# Altium schematic sheet top.SchDoc
size C; SheetNumber: 1
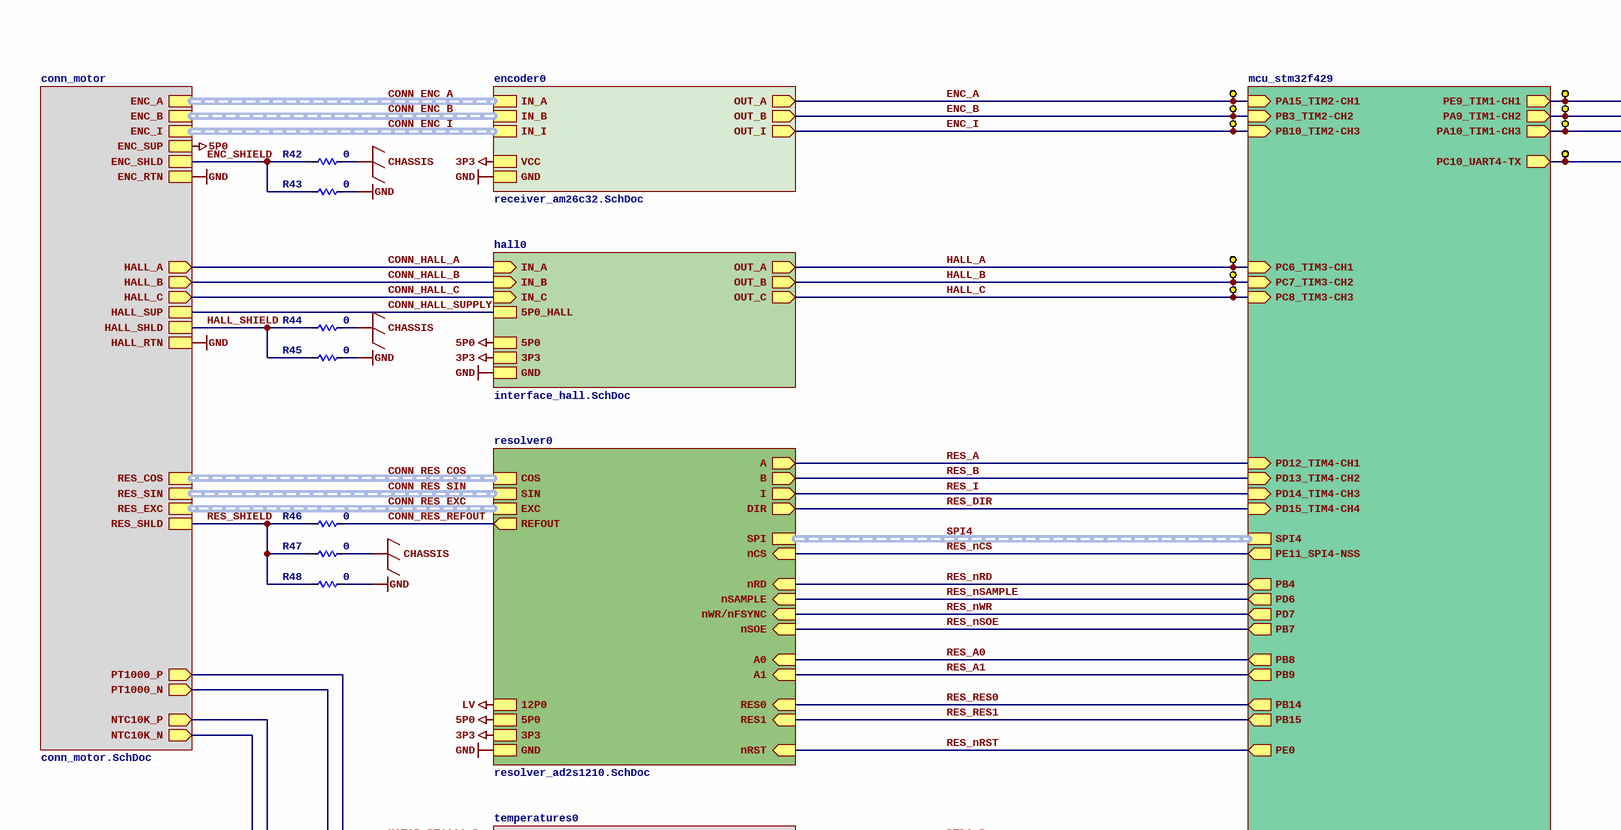
[diagram p0: top.SchDoc, top left]
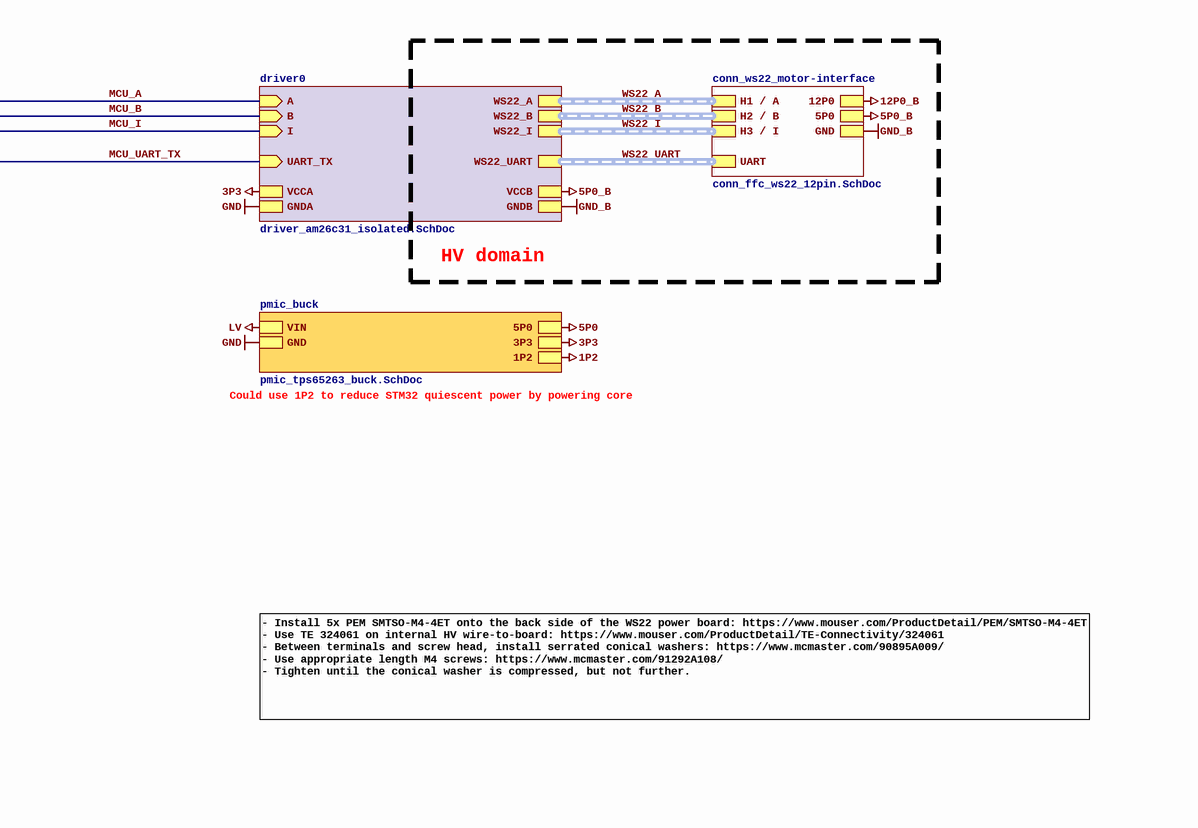
[diagram p1: top.SchDoc, top right]
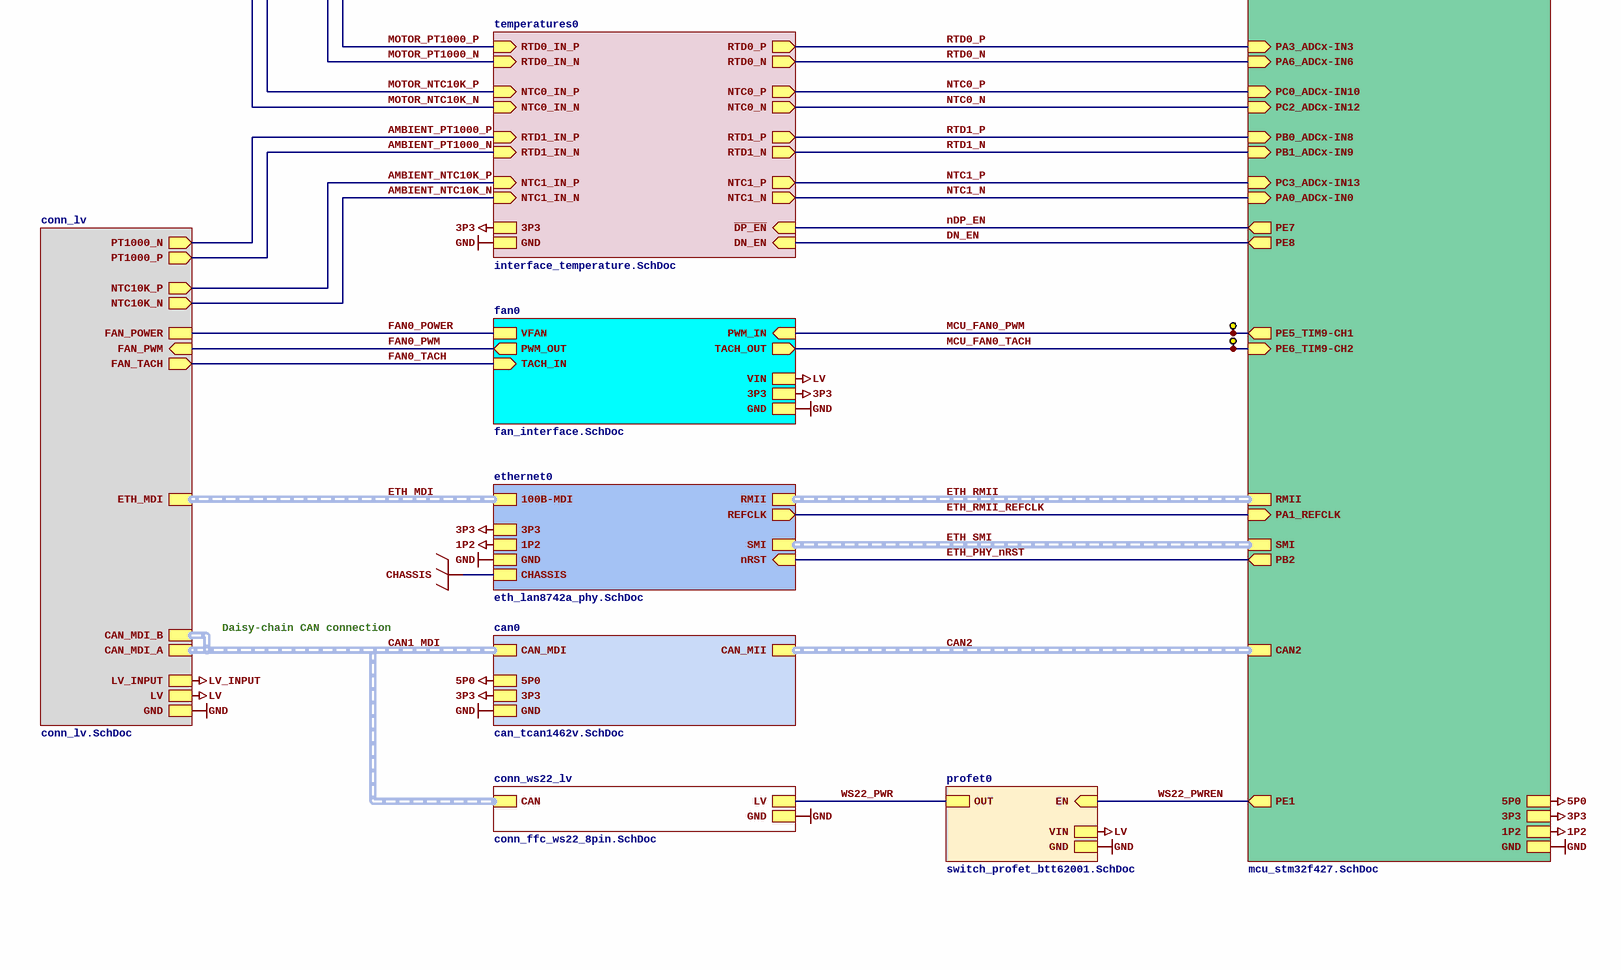
[diagram p2: top.SchDoc, bottom left]
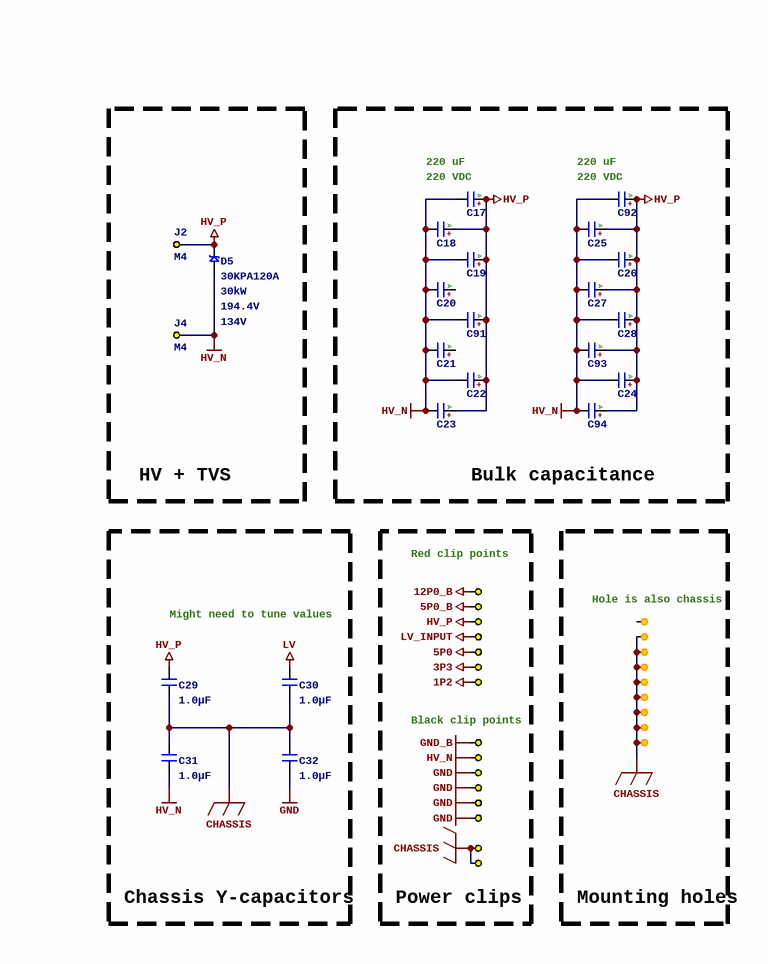
[diagram p3: top.SchDoc, bottom right]

## Parts
C17  EKXJ221ELL221MM25S  [CAP_1600X2700X750]  (value not drawn)
C18  EKXJ221ELL221MM25S  [CAP_1600X2700X750]  (value not drawn)
C19  EKXJ221ELL221MM25S  [CAP_1600X2700X750]  (value not drawn)
C20  EKXJ221ELL221MM25S  [CAP_1600X2700X750]  (value not drawn)
C21  EKXJ221ELL221MM25S  [CAP_1600X2700X750]  (value not drawn)
C22  EKXJ221ELL221MM25S  [CAP_1600X2700X750]  (value not drawn)
C23  EKXJ221ELL221MM25S  [CAP_1600X2700X750]  (value not drawn)
C24  EKXJ221ELL221MM25S  [CAP_1600X2700X750]  (value not drawn)
C25  EKXJ221ELL221MM25S  [CAP_1600X2700X750]  (value not drawn)
C26  EKXJ221ELL221MM25S  [CAP_1600X2700X750]  (value not drawn)
C27  EKXJ221ELL221MM25S  [CAP_1600X2700X750]  (value not drawn)
C28  EKXJ221ELL221MM25S  [CAP_1600X2700X750]  (value not drawn)
C29  Capacitance: 1.0µF  [KNSCHA-CAP-MPB-S]  (hidden comment: MPB105J2WD4KN1580S)
C30  Capacitance: 1.0µF  [KNSCHA-CAP-MPB-S]  (hidden comment: MPB105J2WD4KN1580S)
C31  Capacitance: 1.0µF  [KNSCHA-CAP-MPB-S]  (hidden comment: MPB105J2WD4KN1580S)
C32  Capacitance: 1.0µF  [KNSCHA-CAP-MPB-S]  (hidden comment: MPB105J2WD4KN1580S)
C91  EKXJ221ELL221MM25S  [CAP_1600X2700X750]  (value not drawn)
C92  EKXJ221ELL221MM25S  [CAP_1600X2700X750]  (value not drawn)
C93  EKXJ221ELL221MM25S  [CAP_1600X2700X750]  (value not drawn)
C94  EKXJ221ELL221MM25S  [CAP_1600X2700X750]  (value not drawn)
D5  30KPA120A  Non-rep Peak Rev Power Dis-Max: 30kW  Clamping Voltage-Max: 194.4V  Min Breakdown Voltage: 134V  [P600]
J2  Thread Size: M4  [WURTH_TERM_7461086]  (hidden comment: 7461086)
J4  Thread Size: M4  [WURTH_TERM_7461086]  (hidden comment: 7461086)
MH1  HOLE_M3  [HOLE_M3]  (value not drawn)  (no BOM)
MH2  HOLE_M3  [HOLE_M3]  (value not drawn)  (no BOM)
MH3  HOLE_M3  [HOLE_M3]  (value not drawn)  (no BOM)
MH4  HOLE_M3  [HOLE_M3]  (value not drawn)  (no BOM)
MH5  HOLE_M3  [HOLE_M3]  (value not drawn)  (no BOM)
MH6  HOLE_M3  [HOLE_M3]  (value not drawn)  (no BOM)
MH7  HOLE_M3  [HOLE_M3]  (value not drawn)  (no BOM)
MH8  HOLE_M3  [HOLE_M3]  (value not drawn)  (no BOM)
MH9  HOLE_M3  [HOLE_M3]  (value not drawn)  (no BOM)
R42  Resistance: 0  [R0402_0.40MM]  (hidden comment: ERJ-2GE0R00X)
R43  Resistance: 0  [R0402_0.40MM]  (hidden comment: ERJ-2GE0R00X)
R44  Resistance: 0  [R0402_0.40MM]  (hidden comment: ERJ-2GE0R00X)
R45  Resistance: 0  [R0402_0.40MM]  (hidden comment: ERJ-2GE0R00X)
R46  Resistance: 0  [R0402_0.40MM]  (hidden comment: ERJ-2GE0R00X)
R47  Resistance: 0  [R0402_0.40MM]  (hidden comment: ERJ-2GE0R00X)
R48  Resistance: 0  [R0402_0.40MM]  (hidden comment: ERJ-2GE0R00X)
TP8  (no value)  [TP_GRABBY]  (no BOM)
TP9  (no value)  [TP_GRABBY]  (no BOM)
TP10  (no value)  [TP_GRABBY]  (no BOM)
TP11  (no value)  [TP_GRABBY]  (no BOM)
TP12  (no value)  [TP_GRABBY]  (no BOM)
TP13  (no value)  [TP_GRABBY]  (no BOM)
TP14  (no value)  [TP_GRABBY]  (no BOM)
TP15  (no value)  [TP_GRABBY]  (no BOM)
TP16  (no value)  [TP_GRABBY]  (no BOM)
TP17  (no value)  [TP_GRABBY]  (no BOM)
TP32  (no value)  [TP_GRABBY]  (no BOM)
TP33  (no value)  [TP_GRABBY]  (no BOM)
TP37  RH-5000  [TP_RH-5000]  (value not drawn)
TP38  RH-5000  [TP_RH-5000]  (value not drawn)
TP39  RH-5000  [TP_RH-5000]  (value not drawn)
TP41  RH-5000  [TP_RH-5000]  (value not drawn)
TP42  RH-5000  [TP_RH-5000]  (value not drawn)
TP43  RH-5000  [TP_RH-5000]  (value not drawn)
TP44  RH-5000  [TP_RH-5000]  (value not drawn)
TP45  RH-5001  [TP_RH-5001]  (value not drawn)
TP47  RH-5001  [TP_RH-5001]  (value not drawn)
TP48  RH-5001  [TP_RH-5001]  (value not drawn)
TP49  RH-5001  [TP_RH-5001]  (value not drawn)
TP50  RH-5001  [TP_RH-5001]  (value not drawn)
TP51  RH-5001  [TP_RH-5001]  (value not drawn)
TP52  RH-5001  [TP_RH-5001]  (value not drawn)
TP53  RH-5001  [TP_RH-5001]  (value not drawn)

## Blocks framed on the sheet
HV + TVS: D5 J2 J4
Bulk capacitance: C17-C28 C91-C94
Chassis Y-capacitors: C29-C32
Power clips: TP37-TP39 TP41-TP45 TP47-TP53
Mounting holes: MH1-MH9

## Sub-sheets
can0 = can_tcan1462v.SchDoc: GND, 5P0, CAN_MII (harness CAN), CAN_MDI (harness DIFF), 3P3
conn_lv = conn_lv.SchDoc: ETH_MDI (harness 100BASE-TX), CAN_MDI_A (harness DIFF), FAN_PWM (in), FAN_TACH (out), GND, LV, PT1000_N (out), PT1000_P (out), FAN_POWER, CAN_MDI_B (harness DIFF), NTC10K_P (out), NTC10K_N (out), LV_INPUT
conn_motor = conn_motor.SchDoc: RES_SHLD, RES_EXC (harness DIFF), RES_COS (harness DIFF), RES_SIN (harness DIFF), PT1000_P (out), PT1000_N (out), NTC10K_P (out), NTC10K_N (out), ENC_A (harness DIFF), ENC_B (harness DIFF), ENC_I (harness DIFF), ENC_SHLD, ENC_SUP, ENC_RTN, HALL_RTN, HALL_SUP, HALL_A (out), HALL_B (out), HALL_C (out), HALL_SHLD
conn_ws22_lv = conn_ffc_ws22_8pin.SchDoc: CAN (harness DIFF), GND, LV
conn_ws22_motor-interface = conn_ffc_ws22_12pin.SchDoc: H1 / A (harness DIFF), H2 / B (harness DIFF), H3 / I (harness DIFF), UART (harness DIFF), GND, 12P0, 5P0
driver0 = driver_am26c31_isolated.SchDoc: WS22_UART (harness DIFF), WS22_I (harness DIFF), WS22_B (harness DIFF), WS22_A (harness DIFF), UART_TX (in), I (in), B (in), A (in), VCCB, GNDB, VCCA, GNDA
encoder0 = receiver_am26c32.SchDoc: VCC, GND, IN_I (harness DIFF), IN_B (harness DIFF), IN_A (harness DIFF), OUT_I (out), OUT_B (out), OUT_A (out)
ethernet0 = eth_lan8742a_phy.SchDoc: 3P3, 1P2, GND, REFCLK (out), SMI (harness SMI), RMII (harness RMII), 100B-MDI (harness 100BASE-TX), nRST (in), CHASSIS
fan0 = fan_interface.SchDoc: GND, 3P3, VFAN, PWM_IN (in), TACH_IN (in), VIN, TACH_OUT (out), PWM_OUT (out)
hall0 = interface_hall.SchDoc: IN_B (in), IN_A (in), IN_C (in), OUT_B (out), OUT_A (out), OUT_C (out), 5P0, 3P3, GND, 5P0_HALL
mcu_stm32f429 = mcu_stm32f427.SchDoc: GND, 3P3, CAN2 (harness CAN), PA1_REFCLK (in), RMII (harness RMII), SMI (harness SMI), 5P0, 1P2, PA15_TIM2-CH1 (in), PE7 (out), PE8 (out), PA0_ADCx-IN0 (in), PC3_ADCx-IN13 (in), PB1_ADCx-IN9 (in), PB0_ADCx-IN8 (in), PC2_ADCx-IN12 (in), PC0_ADCx-IN10 (in), PA6_ADCx-IN6 (in), PA3_ADCx-IN3 (in), PC8_TIM3-CH3 (in), PB3_TIM2-CH2 (in), PC6_TIM3-CH1 (in), PC7_TIM3-CH2 (in), PB10_TIM2-CH3 (in), PD12_TIM4-CH1 (in), PD13_TIM4-CH2 (in), PD14_TIM4-CH3 (in), PD15_TIM4-CH4 (in), SPI4 (harness SPI), PE11_SPI4-NSS (out), PB4 (out), PD6 (out), PD7 (out), PB7 (out), PB8 (out), PB9 (out), PB14 (out), PB15 (out), PE0 (out), PE9_TIM1-CH1 (out), PA9_TIM1-CH2 (out), PA10_TIM1-CH3 (out), PC10_UART4-TX (out), PE5_TIM9-CH1 (out), PE6_TIM9-CH2 (in), PB2 (out), PE1 (out)
pmic_buck = pmic_tps65263_buck.SchDoc: VIN, 5P0, GND, 3P3, 1P2
profet0 = switch_profet_btt62001.SchDoc: EN (in), GND, OUT, VIN
resolver0 = resolver_ad2s1210.SchDoc: COS (harness DIFF), SIN (harness DIFF), REFOUT (out), EXC (harness DIFF), 12P0, 5P0, GND, RES0 (in), RES1 (in), A (out), B (out), I (out), DIR (out), nRST (in), A0 (in), A1 (in), 3P3, SPI (harness SPI), nRD (in), nCS (in), nSAMPLE (in), nWR/nFSYNC (in), nSOE (in)
temperatures0 = interface_temperature.SchDoc: NTC0_P (out), NTC0_N (out), NTC1_P (out), NTC1_N (out), RTD0_P (out), RTD0_N (out), RTD1_P (out), RTD1_N (out), 3P3, GND, DN_EN (in), ~{DP_EN} (in), NTC0_IN_P (in), NTC0_IN_N (in), NTC1_IN_P (in), NTC1_IN_N (in), RTD0_IN_P (in), RTD0_IN_N (in), RTD1_IN_P (in), RTD1_IN_N (in)

## Nets
1P2: TP44.1 ; sheet mcu_stm32f429/1P2, sheet pmic_buck/1P2, sheet ethernet0/1P2
3P3: TP43.1 ; sheet mcu_stm32f429/3P3, sheet pmic_buck/3P3, sheet fan0/3P3, sheet can0/3P3, sheet ethernet0/3P3, sheet driver0/VCCA, sheet resolver0/3P3, sheet hall0/3P3, sheet encoder0/VCC, sheet temperatures0/3P3
5P0: TP42.1 ; sheet mcu_stm32f429/5P0, sheet pmic_buck/5P0, sheet can0/5P0, sheet conn_motor/ENC_SUP, sheet resolver0/5P0, sheet hall0/5P0
5P0_B: TP38.1 ; sheet conn_ws22_motor-interface/5P0, sheet driver0/VCCB
12P0_B: TP37.1 ; sheet conn_ws22_motor-interface/12P0
CHASSIS: C29.2 C30.2 C31.1 C32.1 MH1.0 MH2.0 MH3.0 MH4.0 MH5.0 MH6.0 MH7.0 MH8.0 R42.1 R44.1 R47.1 TP52.1 TP53.1 ; sheet ethernet0/CHASSIS
GND: C32.2 R43.1 R45.1 R48.1 TP48.1 TP49.1 TP50.1 TP51.1 ; sheet mcu_stm32f429/GND, sheet pmic_buck/GND, sheet fan0/GND, sheet can0/GND, sheet ethernet0/GND, sheet conn_ws22_lv/GND, sheet conn_lv/GND, sheet conn_motor/ENC_RTN, sheet conn_motor/HALL_RTN, sheet driver0/GNDA, sheet resolver0/GND, sheet profet0/GND, sheet hall0/GND, sheet encoder0/GND, sheet temperatures0/GND
GND_B: TP45.1 ; sheet conn_ws22_motor-interface/GND, sheet driver0/GNDB
HV_N: C17.2 C18.2 C19.2 C20.2 C21.2 C22.2 C23.2 C24.2 C25.2 C26.2 C27.2 C28.2 C31.2 C91.2 C92.2 C93.2 C94.2 D5.1 J4.0 TP47.1
HV_P: C17.1 C18.1 C19.1 C22.1 C23.1 C24.1 C25.1 C26.1 C27.1 C28.1 C29.1 C91.1 C92.1 C93.1 C94.1 D5.2 J2.0 TP39.1
LV: C30.1 ; sheet pmic_buck/VIN, sheet fan0/VIN, sheet conn_lv/LV, sheet resolver0/12P0, sheet profet0/VIN
LV_INPUT: TP41.1 ; sheet conn_lv/LV_INPUT
AMBIENT_NTC10K_N: sheet conn_lv/NTC10K_N, sheet temperatures0/NTC1_IN_N
AMBIENT_NTC10K_P: sheet conn_lv/NTC10K_P, sheet temperatures0/NTC1_IN_P
AMBIENT_PT1000_N: sheet conn_lv/PT1000_P, sheet temperatures0/RTD1_IN_N
AMBIENT_PT1000_P: sheet conn_lv/PT1000_N, sheet temperatures0/RTD1_IN_P
CONN_HALL_A: sheet conn_motor/HALL_A, sheet hall0/IN_A
CONN_HALL_B: sheet conn_motor/HALL_B, sheet hall0/IN_B
CONN_HALL_C: sheet conn_motor/HALL_C, sheet hall0/IN_C
CONN_HALL_SUPPLY: sheet conn_motor/HALL_SUP, sheet hall0/5P0_HALL
CONN_RES_REFOUT: R46.1 ; sheet resolver0/REFOUT
DN_EN: sheet mcu_stm32f429/PE8, sheet temperatures0/DN_EN
ENC_A: TP8.1 ; sheet mcu_stm32f429/PA15_TIM2-CH1, sheet encoder0/OUT_A
ENC_B: TP10.1 ; sheet mcu_stm32f429/PB3_TIM2-CH2, sheet encoder0/OUT_B
ENC_I: TP12.1 ; sheet mcu_stm32f429/PB10_TIM2-CH3, sheet encoder0/OUT_I
ENC_SHIELD: R42.2 R43.2 ; sheet conn_motor/ENC_SHLD
ETH_PHY_nRST: sheet mcu_stm32f429/PB2, sheet ethernet0/nRST
ETH_RMII_REFCLK: sheet mcu_stm32f429/PA1_REFCLK, sheet ethernet0/REFCLK
FAN0_POWER: sheet fan0/VFAN, sheet conn_lv/FAN_POWER
FAN0_PWM: sheet fan0/PWM_OUT, sheet conn_lv/FAN_PWM
FAN0_TACH: sheet fan0/TACH_IN, sheet conn_lv/FAN_TACH
HALL_A: TP15.1 ; sheet mcu_stm32f429/PC6_TIM3-CH1, sheet hall0/OUT_A
HALL_B: TP16.1 ; sheet mcu_stm32f429/PC7_TIM3-CH2, sheet hall0/OUT_B
HALL_C: TP17.1 ; sheet mcu_stm32f429/PC8_TIM3-CH3, sheet hall0/OUT_C
HALL_SHIELD: R44.2 R45.2 ; sheet conn_motor/HALL_SHLD
MCU_A: TP9.1 ; sheet mcu_stm32f429/PE9_TIM1-CH1, sheet driver0/A
MCU_B: TP11.1 ; sheet mcu_stm32f429/PA9_TIM1-CH2, sheet driver0/B
MCU_FAN0_PWM: TP32.1 ; sheet mcu_stm32f429/PE5_TIM9-CH1, sheet fan0/PWM_IN
MCU_FAN0_TACH: TP33.1 ; sheet mcu_stm32f429/PE6_TIM9-CH2, sheet fan0/TACH_OUT
MCU_I: TP13.1 ; sheet mcu_stm32f429/PA10_TIM1-CH3, sheet driver0/I
MCU_UART_TX: TP14.1 ; sheet mcu_stm32f429/PC10_UART4-TX, sheet driver0/UART_TX
MOTOR_NTC10K_N: sheet conn_motor/NTC10K_N, sheet temperatures0/NTC0_IN_N
MOTOR_NTC10K_P: sheet conn_motor/NTC10K_P, sheet temperatures0/NTC0_IN_P
MOTOR_PT1000_N: sheet conn_motor/PT1000_N, sheet temperatures0/RTD0_IN_N
MOTOR_PT1000_P: sheet conn_motor/PT1000_P, sheet temperatures0/RTD0_IN_P
nDP_EN: sheet mcu_stm32f429/PE7, sheet temperatures0/~{DP_EN}
NTC0_N: sheet mcu_stm32f429/PC2_ADCx-IN12, sheet temperatures0/NTC0_N
NTC0_P: sheet mcu_stm32f429/PC0_ADCx-IN10, sheet temperatures0/NTC0_P
NTC1_N: sheet mcu_stm32f429/PA0_ADCx-IN0, sheet temperatures0/NTC1_N
NTC1_P: sheet mcu_stm32f429/PC3_ADCx-IN13, sheet temperatures0/NTC1_P
RES_A: sheet mcu_stm32f429/PD12_TIM4-CH1, sheet resolver0/A
RES_A0: sheet mcu_stm32f429/PB8, sheet resolver0/A0
RES_A1: sheet mcu_stm32f429/PB9, sheet resolver0/A1
RES_B: sheet mcu_stm32f429/PD13_TIM4-CH2, sheet resolver0/B
RES_DIR: sheet mcu_stm32f429/PD15_TIM4-CH4, sheet resolver0/DIR
RES_I: sheet mcu_stm32f429/PD14_TIM4-CH3, sheet resolver0/I
RES_nCS: sheet mcu_stm32f429/PE11_SPI4-NSS, sheet resolver0/nCS
RES_nRD: sheet mcu_stm32f429/PB4, sheet resolver0/nRD
RES_nRST: sheet mcu_stm32f429/PE0, sheet resolver0/nRST
RES_nSAMPLE: sheet mcu_stm32f429/PD6, sheet resolver0/nSAMPLE
RES_nSOE: sheet mcu_stm32f429/PB7, sheet resolver0/nSOE
RES_nWR: sheet mcu_stm32f429/PD7, sheet resolver0/nWR/nFSYNC
RES_RES0: sheet mcu_stm32f429/PB14, sheet resolver0/RES0
RES_RES1: sheet mcu_stm32f429/PB15, sheet resolver0/RES1
RES_SHIELD: R46.2 R47.2 R48.2 ; sheet conn_motor/RES_SHLD
RTD0_N: sheet mcu_stm32f429/PA6_ADCx-IN6, sheet temperatures0/RTD0_N
RTD0_P: sheet mcu_stm32f429/PA3_ADCx-IN3, sheet temperatures0/RTD0_P
RTD1_N: sheet mcu_stm32f429/PB1_ADCx-IN9, sheet temperatures0/RTD1_N
RTD1_P: sheet mcu_stm32f429/PB0_ADCx-IN8, sheet temperatures0/RTD1_P
WS22_PWR: sheet conn_ws22_lv/LV, sheet profet0/OUT
WS22_PWREN: sheet mcu_stm32f429/PE1, sheet profet0/EN

Not connected (* = marked no-connect by the designer): C20 1; C21 1; MH9 0

## Buses and harness runs
harness CAN1_MDI = sheet can0/CAN_MDI = sheet conn_lv/CAN_MDI_A = sheet conn_lv/CAN_MDI_B = sheet conn_ws22_lv/CAN
harness CAN2 = sheet can0/CAN_MII = sheet mcu_stm32f429/CAN2
harness CONN_ENC_A = sheet conn_motor/ENC_A = sheet encoder0/IN_A
harness CONN_ENC_B = sheet conn_motor/ENC_B = sheet encoder0/IN_B
harness CONN_ENC_I = sheet conn_motor/ENC_I = sheet encoder0/IN_I
harness CONN_RES_COS = sheet conn_motor/RES_COS = sheet resolver0/COS
harness CONN_RES_EXC = sheet conn_motor/RES_EXC = sheet resolver0/EXC
harness CONN_RES_SIN = sheet conn_motor/RES_SIN = sheet resolver0/SIN
harness ETH_MDI = sheet conn_lv/ETH_MDI = sheet ethernet0/100B-MDI
harness ETH_RMII = sheet ethernet0/RMII = sheet mcu_stm32f429/RMII
harness ETH_SMI = sheet ethernet0/SMI = sheet mcu_stm32f429/SMI
harness SPI4 = sheet mcu_stm32f429/SPI4 = sheet resolver0/SPI
harness WS22_A = sheet conn_ws22_motor-interface/H1 / A = sheet driver0/WS22_A
harness WS22_B = sheet conn_ws22_motor-interface/H2 / B = sheet driver0/WS22_B
harness WS22_I = sheet conn_ws22_motor-interface/H3 / I = sheet driver0/WS22_I
harness WS22_UART = sheet conn_ws22_motor-interface/UART = sheet driver0/WS22_UART

## Notes on the sheet
- HV domain
- Could use 1P2 to reduce STM32 quiescent power by powering core
- - Install 5x PEM SMTSO-M4-4ET onto the back side of the WS22 power board: https://www.mouser.com/ProductDetail/PEM/SMTSO-M4-4ET
  - Use TE 324061 on internal HV wire-to-board: https://www.mouser.com/ProductDetail/TE-Connectivity/324061
  - Between terminals and screw head, install serrated conical washers: https://www.mcmaster.com/90895A009/
  - Use appropriate length M4 screws: https://www.mcmaster.com/91292A108/
  - Tighten until the conical washer is compressed, but not further.
- (near C17) 220 uF
- (near C17) 220 VDC
- (near C92) 220 uF
- (near C92) 220 VDC
- Daisy-chain CAN connection
- Red clip points
- (near MH9) Hole is also chassis
- Might need to tune values
- (near TP45) Black clip points
- (in symbol AUTO_CAP_ALUM_220UF_220V_EKXJ221ELL221MM25S) A; +

## Library data of the parts
C17-C28 C91-C94 = AUTO_CAP_ALUM_220UF_220V_EKXJ221ELL221MM25S: Aluminum Electrolytic Capacitor, Polarized, Aluminum (wet), 220V, 20% +Tol, 20% -Tol, 220uF, Through Hole Mount; Manufacturer: United Chemi-Con; Manufacturer Part Number: EKXJ221ELL221MM25S; ComponentLink4URL: http://www.chemi-con.co.jp/cgi-bin/CAT_DB/SEARCH/cat_db_al.cgi?e=e&amp;j=p&amp;pdfname=kxj; ComponentLink4Description: Datasheet; Supplier 1: Digikey; Supplier Part Number 1: 565-EKXJ221ELL221MM25S-ND; Supplier 2: LCSC; Supplier Part Number 2: C1600234
C29-C32 = CAP_FILM_1UF_450V: CAP FILM 1UF 5% 450V RADIAL; Manufacturer: KNSCHA; Supplier 1: LCSC; Manufacturer Part Number: MPB105J2WD4KN1580S; ComponentLink1URL: https://www.lcsc.com/datasheet/lcsc_datasheet_2405161619_KNSCHA-MPB105J2WD4KN1580S_C22400108.pdf; ComponentLink1Description: Datasheet; Supplier Part Number 1: C22400108
D5 = TVS_UNI_30KPA120A: Trans Voltage Suppressor Diode, 30000W, 120V V(RWM), Unidirectional, 1 Element, Silicon; Manufacturer: Littelfuse; Supplier 1: Digikey; Supplier Part Number 1: 30KPA120A-ND; Manufacturer Part Number: 30KPA120A; ComponentLink1URL: https://mm.digikey.com/Volume0/opasdata/d220001/medias/docus/4180/30KPA_Series.pdf; ComponentLink1Description: Datasheet; Supplier 2: LCSC; Supplier Part Number 2: C1984717
J2 J4 = CONN_WURTH_7461086: POWER ELEMENT BUSH M4 12PIN; Manufacturer: Wurth Electronics; Supplier 1: Digikey; Supplier Part Number 1: 732-3207-ND; Manufacturer Part Number: 7461086
R42-R48 = ERJ-2GE0R00X: RES SMD 0 OHM JUMPER 1/10W 0402; Manufacturer: Panasonic Electronic Components; Unit Price (USD): 0.1; Power (Watts): 0.1W, 1/10W; ComponentLink1Description: Datasheet; ComponentLink1URL: http://industrial.panasonic.com/www-cgi/jvcr13pz.cgi?E+PZ+3+AOA0001+ERJ2GE0R00X+7+WW; Series: ERJ; Tolerance: Jumper; Composition: Thick Film; Features: Automotive AEC-Q200; Temperature Coefficient: -; Operating Temperature: -55°C ~ 155°C; Package / Case: 0402 (1005 Metric); Supplier Device Package: 0402; Size / Dimension: 0.039" L x 0.020" W (1.00mm x 0.50mm); Height - Seated (Max): 0.016" (0.40mm); Supplier 1: Digikey; Supplier Part Number 1: P0.0JCT-ND; Manufacturer Part Number: ERJ-2GE0R00X
TP8-TP17 TP32 TP33 = TEST_GRABBER: EMBEDDED TEST POINT FOR SALEAE TEST CLIPS
TP37-TP39 TP41-TP44 = RH-5000: THT red clip turret; Manufacturer: ronghe; ComponentLink1Description: Datasheet; ComponentLink1URL: https://datasheet.lcsc.com/lcsc/2307040929_ronghe-RH-5000_C5277086.pdf; Supplier 1: LCSC; Supplier Part Number 1: C5277086; Manufacturer Part Number: RH-5000
TP45 TP47-TP53 = RH-5001: THT black clip turret; Manufacturer: ronghe; ComponentLink1Description: Datasheet; ComponentLink1URL: https://datasheet.lcsc.com/lcsc/2307040929_ronghe-RH-5000_C5277086.pdf; Supplier 1: LCSC; Supplier Part Number 1: C5199801; Manufacturer Part Number: RH-5001